# Altium schematic sheet Power.SchDoc
size 420 x 297 mm; SheetNumber: 5; SheetTotal: 6
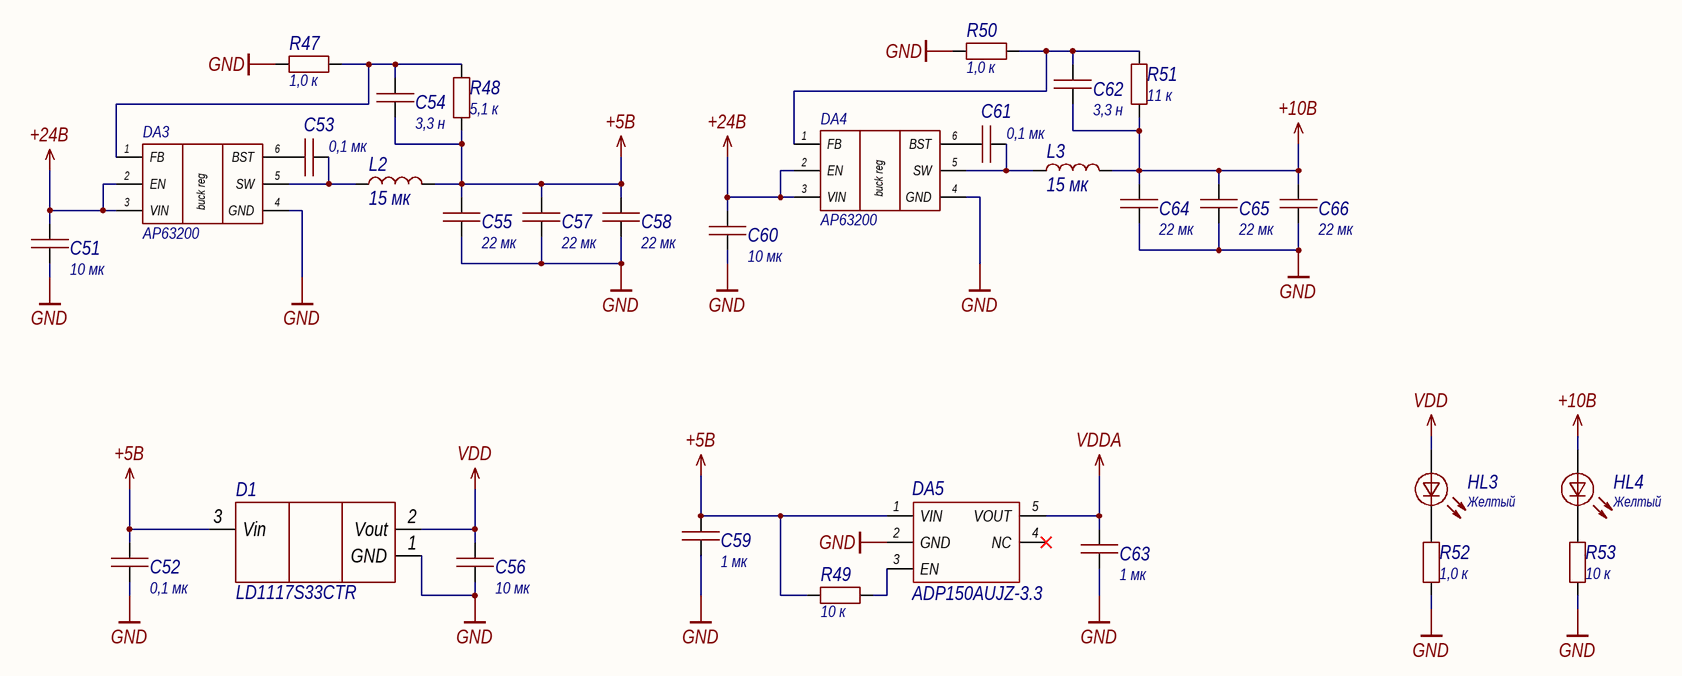
[diagram p0: Power.SchDoc]

## Parts
C51  value 10 мк  [1210C]  (hidden comment: Capacitor)
C52  value 0,1 мк  [0603C]  (hidden comment: Capacitor)
C53  value 0,1 мк  [0603C]  (hidden comment: Capacitor)
C54  value 3,3 н  [0603C]  (hidden comment: Capacitor)
C55  value 22 мк  [1210C]  (hidden comment: Capacitor)
C56  value 10 мк  [1210C]  (hidden comment: Capacitor)
C57  value 22 мк  [1210C]  (hidden comment: Capacitor)
C58  value 22 мк  [1210C]  (hidden comment: Capacitor)
C59  value 1 мк  [0603C]  (hidden comment: Capacitor)
C60  value 10 мк  [1210C]  (hidden comment: Capacitor)
C61  value 0,1 мк  [0603C]  (hidden comment: Capacitor)
C62  value 3,3 н  [0603C]  (hidden comment: Capacitor)
C63  value 1 мк  [0603C]  (hidden comment: Capacitor)
C64  value 22 мк  [1210C]  (hidden comment: Capacitor)
C65  value 22 мк  [1210C]  (hidden comment: Capacitor)
C66  value 22 мк  [1210C]  (hidden comment: Capacitor)
D1  LD1117S33CTR  [SOT223]
DA3  AP63200  [TSOT26]
DA4  AP63200  [TSOT26]
DA5  ADP150AUJZ-3.3  [SOT23-5]
HL3  value Желтый  [0805D]  (hidden comment: LED)
HL4  value Желтый  [0805D]  (hidden comment: LED)
L2  value 15 мк  [SP43]  (hidden comment: SP43-150K)
L3  value 15 мк  [SP43]  (hidden comment: SP43-150K)
R47  value 1,0 к  [0603R]  (hidden comment: Resistor)
R48  value 5,1 к  [0603R]  (hidden comment: Resistor)
R49  value 10 к  [0603R]  (hidden comment: Resistor)
R50  value 1,0 к  [0603R]  (hidden comment: Resistor)
R51  value 11 к  [0603R]  (hidden comment: Resistor)
R52  value 1,0 к  [0603R]  (hidden comment: Resistor)
R53  value 10 к  [0603R]  (hidden comment: Resistor)

## Nets
+5В: C52.2 C54.2 C55.2 C57.2 C58.2 C59.2 D1.3(Vin) DA5.1(VIN) L2.2 R48.2 R49.2
+10В: C62.2 C64.2 C65.2 C66.2 HL4.1 L3.2 R51.1
+24В: C51.2 C60.2 DA3.2(EN) DA3.3(VIN) DA4.2(EN) DA4.3(VIN)
GND: C51.1 C52.1 C55.1 C56.1 C57.1 C58.1 C59.1 C60.1 C63.1 C64.1 C65.1 C66.1 D1.1(GND) DA3.4(GND) DA4.4(GND) DA5.2(GND) R47.1 R50.1 R52.1 R53.1
VDD: C56.2 D1.2(Vout) HL3.1
VDDA: C63.2 DA5.5(VOUT)
NetC53_1: C53.1 DA3.6(BST)
NetC53_2: C53.2 DA3.5(SW) L2.1
NetC54_1: C54.1 DA3.1(FB) R47.2 R48.1
NetC61_1: C61.1 DA4.6(BST)
NetC61_2: C61.2 DA4.5(SW) L3.1
NetC62_1: C62.1 DA4.1(FB) R50.2 R51.2
NetDA5_3: DA5.3(EN) R49.1
NetHL3_2: HL3.2 R52.2
NetHL4_2: HL4.2 R53.2

Not connected (* = marked no-connect by the designer): DA5 4(NC)*

## Notes on the sheet
- Перв. примен.
- Справ. №
- Подп. и дата
- Инв. № дубл.
- Взам. инв. №
- Инв. № подл.
- Изм.
- Лист
- № докум.
- Подп.
- Дата
- Копировал
- Формат А3
- (in symbol AP63200) buck reg

## Library data of the parts
C51 C56 C60 = Capacitor_10u_10_35V_X7R_1210C: Конденсатор 1210C ёмкостью 10 мк 10%, 35 В, X7R; Voltage (V): 35; Capacity (nF): 10000; Part Number: Capacitor_10u_10_35V_X7R_1210C; Tolerance: 10%; Dielectric: X7R
C52 C53 C61 = Capacitor_0,1u_10_50V_X7R_0603C: Конденсатор 0603C ёмкостью 0,1 мк 10%, 50 В, X7R; Voltage (V): 50; Capacity (nF): 100; Part Number: Capacitor_0,1u_10_50V_X7R_0603C; Tolerance: 10%; Dielectric: X7R
C54 C62 = Capacitor_3.3n_5_50V_NP0_0603C: Конденсатор 0603C ёмкостью 3,3 н 5%, 50 В, NP0; Voltage (V): 50; Capacity (nF): 3,3; Автор: glebmih; Part Number: Capacitor_3.3n_5_50V_NP0_0603C; Tolerance: 5%; Dielectric: NP0
C55 C57 C58 C64-C66 = Capacitor_22u_10_25V_X7R_1210C: Конденсатор 1210C ёмкостью 22 мк 10%, 25 В, X7R; Voltage (V): 25; Capacity (nF): 22000; Part Number: Capacitor_22u_10_25V_X7R_1210C; Tolerance: 10%; Dielectric: X7R
C59 C63 = Capacitor_1u_10_25V_X7R_0603C: Конденсатор 0603C ёмкостью 1 мк 10%, 25 В, X7R; Voltage (V): 25; Capacity (nF): 1000; Part Number: Capacitor_1u_10_25V_X7R_0603C; Tolerance: 10%; Dielectric: X7R
D1 = LD1117S33CTR: Линейный стабилизатор напряжения; Part Number: LD1117S33CTR
DA3 DA4 = AP63200: DC-DC понижающий преобразователь, Vin: 3.8 - 40 В, adj, 2 А; Part Number: AP63200
DA5 = ADP150AUJZ-3.3: Стабилизатор напряжения 3.3В 150мА; Автор: glebmih; Part Number: ADP150AUJZ-3.3; Datasheet: https://static.chipdip.ru/lib/986/DOC003986581.pdf
HL3 HL4 = LED: Светодиод; Part Number: LED
L2 L3 = SP43-150K: Индуктивность на 15 мкГн, номинальный ток 1,3 А; Inductance (μH): 15; Current: 1,3 А; Part Number: SP43-150K
R47 R50 R52 = Resistor_1.0k_1_0603: Резистор номиналом 1,0 кОм 1%; Power: *; Part Number: Resistor_1.0k_1_0603; Tolerance: 1%
R48 = Resistor_5.1k_1_0603: Резистор номиналом 5,1 кОм 1%; Power: *; Part Number: Resistor_5.1k_1_0603; Tolerance: 1%
R49 R53 = Resistor_10k_1_0603: Резистор номиналом 10 кОм 1%; Power: *; Part Number: Resistor_10k_1_0603; Tolerance: 1%
R51 = Resistor_11k_1_0603: Резистор номиналом 11 кОм 1%; Power: *; Part Number: Resistor_11k_1_0603; Tolerance: 1%